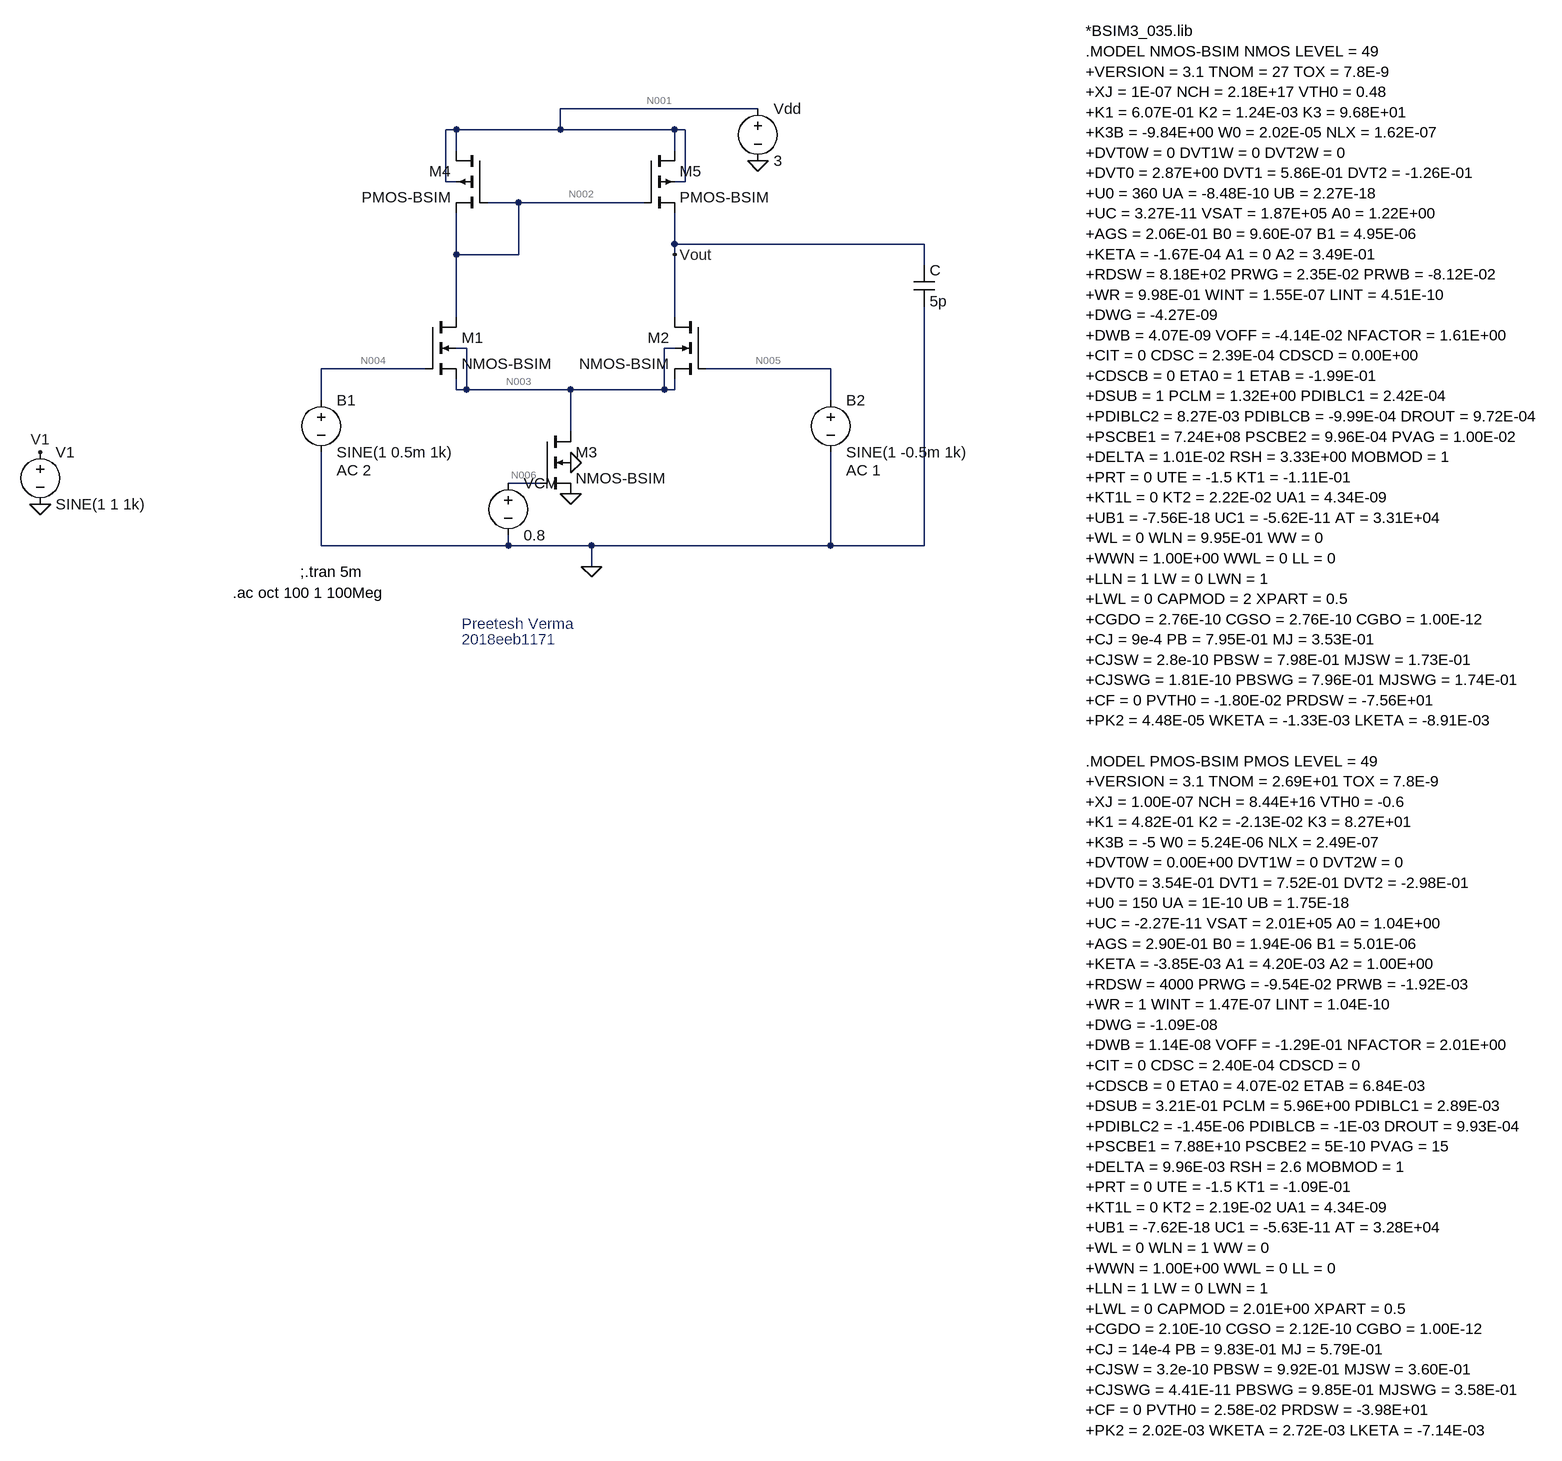
[diagram p0: schematic Question1.asc]
Question1.asc, the LTspice schematic file:
Version 4
SHEET 1 2096 1684
WIRE 528 -144 224 -144
WIRE 64 -112 48 -112
WIRE 224 -112 224 -144
WIRE 224 -112 64 -112
WIRE 400 -112 224 -112
WIRE 416 -112 400 -112
WIRE 64 -80 64 -112
WIRE 400 -80 400 -112
WIRE 48 -32 48 -112
WIRE 64 -32 48 -32
WIRE 416 -32 416 -112
WIRE 416 -32 400 -32
WIRE 160 0 112 0
WIRE 352 0 160 0
WIRE 400 64 400 16
WIRE 784 64 400 64
WIRE 64 80 64 16
WIRE 160 80 160 0
WIRE 160 80 64 80
WIRE 400 80 400 64
WIRE 784 96 784 64
WIRE 64 176 64 80
WIRE 400 176 400 80
WIRE 80 224 64 224
WIRE 400 224 384 224
WIRE 16 256 -144 256
WIRE 640 256 448 256
WIRE 64 288 64 272
WIRE 80 288 80 224
WIRE 80 288 64 288
WIRE 240 288 80 288
WIRE 384 288 384 224
WIRE 384 288 240 288
WIRE 400 288 400 272
WIRE 400 288 384 288
WIRE -144 304 -144 256
WIRE 640 304 640 256
WIRE 240 352 240 288
WIRE 192 432 144 432
WIRE -144 528 -144 384
WIRE 144 528 144 512
WIRE 144 528 -144 528
WIRE 272 528 144 528
WIRE 640 528 640 384
WIRE 640 528 272 528
WIRE 784 528 784 160
WIRE 784 528 640 528
WIRE 272 560 272 528
FLAG 528 -64 0
FLAG 400 80 Vout
FLAG 240 400 0
FLAG 240 448 0
FLAG -576 464 0
FLAG -576 384 V1
FLAG 272 560 0
SYMBOL nmos4 16 176 R0
SYMATTR InstName M1
SYMATTR Value NMOS-BSIM
SYMATTR Value2 l=27u w=160u
SYMBOL nmos4 448 176 M0
SYMATTR InstName M2
SYMATTR Value NMOS-BSIM
SYMATTR Value2 l=27u w=160u
SYMBOL pmos4 352 -80 R0
SYMATTR InstName M5
SYMATTR Value PMOS-BSIM
SYMATTR Value2 l=2.5u w=20u
SYMBOL pmos4 112 -80 M0
SYMATTR InstName M4
SYMATTR Value PMOS-BSIM
SYMATTR Value2 l=2.5u w=20u
SYMBOL voltage -144 288 R0
WINDOW 123 24 124 Left 2
WINDOW 39 0 0 Left 0
SYMATTR Value2 AC 2
SYMATTR InstName B1
SYMATTR Value SINE(1 0.5m 1k)
SYMBOL voltage 640 288 R0
WINDOW 123 24 124 Left 2
WINDOW 39 0 0 Left 0
SYMATTR Value2 AC 1
SYMATTR InstName B2
SYMATTR Value SINE(1 -0.5m 1k)
SYMBOL voltage 528 -160 R0
WINDOW 123 0 0 Left 0
WINDOW 39 0 0 Left 0
SYMATTR InstName Vdd
SYMATTR Value 3
SYMBOL cap 768 96 R0
SYMATTR InstName C
SYMATTR Value 5p
SYMBOL nmos4 192 352 R0
SYMATTR InstName M3
SYMATTR Value NMOS-BSIM
SYMATTR Value2 l=27u w=160u
SYMBOL voltage 144 416 R0
SYMATTR InstName VCM
SYMATTR Value 0.8
SYMBOL voltage -576 368 R0
WINDOW 123 0 0 Left 0
WINDOW 39 0 0 Left 0
SYMATTR InstName V1
SYMATTR Value SINE(1 1 1k)
TEXT -176 568 Left 2 !;.tran 5m
TEXT 1032 -264 Left 2 !*BSIM3_035.lib\n.MODEL NMOS-BSIM NMOS LEVEL = 49\n+VERSION = 3.1 TNOM = 27 TOX = 7.8E-9\n+XJ = 1E-07 NCH = 2.18E+17 VTH0 = 0.48\n+K1 = 6.07E-01 K2 = 1.24E-03 K3 = 9.68E+01\n+K3B = -9.84E+00 W0 = 2.02E-05 NLX = 1.62E-07\n+DVT0W = 0 DVT1W = 0 DVT2W = 0\n+DVT0 = 2.87E+00 DVT1 = 5.86E-01 DVT2 = -1.26E-01\n+U0 = 360 UA = -8.48E-10 UB = 2.27E-18\n+UC = 3.27E-11 VSAT = 1.87E+05 A0 = 1.22E+00\n+AGS = 2.06E-01 B0 = 9.60E-07 B1 = 4.95E-06\n+KETA = -1.67E-04 A1 = 0 A2 = 3.49E-01\n+RDSW = 8.18E+02 PRWG = 2.35E-02 PRWB = -8.12E-02\n+WR = 9.98E-01 WINT = 1.55E-07 LINT = 4.51E-10\n+DWG = -4.27E-09\n+DWB = 4.07E-09 VOFF = -4.14E-02 NFACTOR = 1.61E+00\n+CIT = 0 CDSC = 2.39E-04 CDSCD = 0.00E+00\n+CDSCB = 0 ETA0 = 1 ETAB = -1.99E-01\n+DSUB = 1 PCLM = 1.32E+00 PDIBLC1 = 2.42E-04\n+PDIBLC2 = 8.27E-03 PDIBLCB = -9.99E-04 DROUT = 9.72E-04\n+PSCBE1 = 7.24E+08 PSCBE2 = 9.96E-04 PVAG = 1.00E-02\n+DELTA = 1.01E-02 RSH = 3.33E+00 MOBMOD = 1\n+PRT = 0 UTE = -1.5 KT1 = -1.11E-01\n+KT1L = 0 KT2 = 2.22E-02 UA1 = 4.34E-09\n+UB1 = -7.56E-18 UC1 = -5.62E-11 AT = 3.31E+04\n+WL = 0 WLN = 9.95E-01 WW = 0\n+WWN = 1.00E+00 WWL = 0 LL = 0\n+LLN = 1 LW = 0 LWN = 1\n+LWL = 0 CAPMOD = 2 XPART = 0.5\n+CGDO = 2.76E-10 CGSO = 2.76E-10 CGBO = 1.00E-12\n+CJ = 9e-4 PB = 7.95E-01 MJ = 3.53E-01\n+CJSW = 2.8e-10 PBSW = 7.98E-01 MJSW = 1.73E-01\n+CJSWG = 1.81E-10 PBSWG = 7.96E-01 MJSWG = 1.74E-01\n+CF = 0 PVTH0 = -1.80E-02 PRDSW = -7.56E+01\n+PK2 = 4.48E-05 WKETA = -1.33E-03 LKETA = -8.91E-03\n \n.MODEL PMOS-BSIM PMOS LEVEL = 49\n+VERSION = 3.1 TNOM = 2.69E+01 TOX = 7.8E-9\n+XJ = 1.00E-07 NCH = 8.44E+16 VTH0 = -0.6\n+K1 = 4.82E-01 K2 = -2.13E-02 K3 = 8.27E+01\n+K3B = -5 W0 = 5.24E-06 NLX = 2.49E-07\n+DVT0W = 0.00E+00 DVT1W = 0 DVT2W = 0\n+DVT0 = 3.54E-01 DVT1 = 7.52E-01 DVT2 = -2.98E-01\n+U0 = 150 UA = 1E-10 UB = 1.75E-18\n+UC = -2.27E-11 VSAT = 2.01E+05 A0 = 1.04E+00\n+AGS = 2.90E-01 B0 = 1.94E-06 B1 = 5.01E-06\n+KETA = -3.85E-03 A1 = 4.20E-03 A2 = 1.00E+00\n+RDSW = 4000 PRWG = -9.54E-02 PRWB = -1.92E-03\n+WR = 1 WINT = 1.47E-07 LINT = 1.04E-10\n+DWG = -1.09E-08\n+DWB = 1.14E-08 VOFF = -1.29E-01 NFACTOR = 2.01E+00\n+CIT = 0 CDSC = 2.40E-04 CDSCD = 0\n+CDSCB = 0 ETA0 = 4.07E-02 ETAB = 6.84E-03\n+DSUB = 3.21E-01 PCLM = 5.96E+00 PDIBLC1 = 2.89E-03\n+PDIBLC2 = -1.45E-06 PDIBLCB = -1E-03 DROUT = 9.93E-04\n+PSCBE1 = 7.88E+10 PSCBE2 = 5E-10 PVAG = 15\n+DELTA = 9.96E-03 RSH = 2.6 MOBMOD = 1\n+PRT = 0 UTE = -1.5 KT1 = -1.09E-01\n+KT1L = 0 KT2 = 2.19E-02 UA1 = 4.34E-09\n+UB1 = -7.62E-18 UC1 = -5.63E-11 AT = 3.28E+04\n+WL = 0 WLN = 1 WW = 0\n+WWN = 1.00E+00 WWL = 0 LL = 0\n+LLN = 1 LW = 0 LWN = 1\n+LWL = 0 CAPMOD = 2.01E+00 XPART = 0.5\n+CGDO = 2.10E-10 CGSO = 2.12E-10 CGBO = 1.00E-12\n+CJ = 14e-4 PB = 9.83E-01 MJ = 5.79E-01\n+CJSW = 3.2e-10 PBSW = 9.92E-01 MJSW = 3.60E-01\n+CJSWG = 4.41E-11 PBSWG = 9.85E-01 MJSWG = 3.58E-01\n+CF = 0 PVTH0 = 2.58E-02 PRDSW = -3.98E+01\n+PK2 = 2.02E-03 WKETA = 2.72E-03 LKETA = -7.14E-03
TEXT -280 600 Left 2 !.ac oct 100 1 100Meg
TEXT 72 648 Left 2 ;Preetesh Verma
TEXT 72 672 Left 2 ;2018eeb1171

The netlist it stands for:
* Question1.asc
M1 N002 N004 N003 N003 NMOS-BSIM l=27u w=160u
M2 Vout N005 N003 N003 NMOS-BSIM l=27u w=160u
M5 N001 N002 Vout N001 PMOS-BSIM l=2.5u w=20u
M4 N001 N002 N002 N001 PMOS-BSIM l=2.5u w=20u
V§B1 N004 0 SINE(1 0.5m 1k) AC 2
V§B2 N005 0 SINE(1 -0.5m 1k) AC 1
Vdd N001 0 3
C Vout 0 5p
M3 N003 N006 0 0 NMOS-BSIM l=27u w=160u
VCM N006 0 0.8
V1 V1 0 SINE(1 1 1k)
.model NMOS NMOS
.model PMOS PMOS
.lib standard.mos
;.tran 5m
*BSIM3_035.lib
.MODEL NMOS-BSIM NMOS LEVEL = 49
+VERSION = 3.1 TNOM = 27 TOX = 7.8E-9
+XJ = 1E-07 NCH = 2.18E+17 VTH0 = 0.48
+K1 = 6.07E-01 K2 = 1.24E-03 K3 = 9.68E+01
+K3B = -9.84E+00 W0 = 2.02E-05 NLX = 1.62E-07
+DVT0W = 0 DVT1W = 0 DVT2W = 0
+DVT0 = 2.87E+00 DVT1 = 5.86E-01 DVT2 = -1.26E-01
+U0 = 360 UA = -8.48E-10 UB = 2.27E-18
+UC = 3.27E-11 VSAT = 1.87E+05 A0 = 1.22E+00
+AGS = 2.06E-01 B0 = 9.60E-07 B1 = 4.95E-06
+KETA = -1.67E-04 A1 = 0 A2 = 3.49E-01
+RDSW = 8.18E+02 PRWG = 2.35E-02 PRWB = -8.12E-02
+WR = 9.98E-01 WINT = 1.55E-07 LINT = 4.51E-10
+DWG = -4.27E-09
+DWB = 4.07E-09 VOFF = -4.14E-02 NFACTOR = 1.61E+00
+CIT = 0 CDSC = 2.39E-04 CDSCD = 0.00E+00
+CDSCB = 0 ETA0 = 1 ETAB = -1.99E-01
+DSUB = 1 PCLM = 1.32E+00 PDIBLC1 = 2.42E-04
+PDIBLC2 = 8.27E-03 PDIBLCB = -9.99E-04 DROUT = 9.72E-04
+PSCBE1 = 7.24E+08 PSCBE2 = 9.96E-04 PVAG = 1.00E-02
+DELTA = 1.01E-02 RSH = 3.33E+00 MOBMOD = 1
+PRT = 0 UTE = -1.5 KT1 = -1.11E-01
+KT1L = 0 KT2 = 2.22E-02 UA1 = 4.34E-09
+UB1 = -7.56E-18 UC1 = -5.62E-11 AT = 3.31E+04
+WL = 0 WLN = 9.95E-01 WW = 0
+WWN = 1.00E+00 WWL = 0 LL = 0
+LLN = 1 LW = 0 LWN = 1
+LWL = 0 CAPMOD = 2 XPART = 0.5
+CGDO = 2.76E-10 CGSO = 2.76E-10 CGBO = 1.00E-12
+CJ = 9e-4 PB = 7.95E-01 MJ = 3.53E-01
+CJSW = 2.8e-10 PBSW = 7.98E-01 MJSW = 1.73E-01
+CJSWG = 1.81E-10 PBSWG = 7.96E-01 MJSWG = 1.74E-01
+CF = 0 PVTH0 = -1.80E-02 PRDSW = -7.56E+01
+PK2 = 4.48E-05 WKETA = -1.33E-03 LKETA = -8.91E-03
.MODEL PMOS-BSIM PMOS LEVEL = 49
+VERSION = 3.1 TNOM = 2.69E+01 TOX = 7.8E-9
+XJ = 1.00E-07 NCH = 8.44E+16 VTH0 = -0.6
+K1 = 4.82E-01 K2 = -2.13E-02 K3 = 8.27E+01
+K3B = -5 W0 = 5.24E-06 NLX = 2.49E-07
+DVT0W = 0.00E+00 DVT1W = 0 DVT2W = 0
+DVT0 = 3.54E-01 DVT1 = 7.52E-01 DVT2 = -2.98E-01
+U0 = 150 UA = 1E-10 UB = 1.75E-18
+UC = -2.27E-11 VSAT = 2.01E+05 A0 = 1.04E+00
+AGS = 2.90E-01 B0 = 1.94E-06 B1 = 5.01E-06
+KETA = -3.85E-03 A1 = 4.20E-03 A2 = 1.00E+00
+RDSW = 4000 PRWG = -9.54E-02 PRWB = -1.92E-03
+WR = 1 WINT = 1.47E-07 LINT = 1.04E-10
+DWG = -1.09E-08
+DWB = 1.14E-08 VOFF = -1.29E-01 NFACTOR = 2.01E+00
+CIT = 0 CDSC = 2.40E-04 CDSCD = 0
+CDSCB = 0 ETA0 = 4.07E-02 ETAB = 6.84E-03
+DSUB = 3.21E-01 PCLM = 5.96E+00 PDIBLC1 = 2.89E-03
+PDIBLC2 = -1.45E-06 PDIBLCB = -1E-03 DROUT = 9.93E-04
+PSCBE1 = 7.88E+10 PSCBE2 = 5E-10 PVAG = 15
+DELTA = 9.96E-03 RSH = 2.6 MOBMOD = 1
+PRT = 0 UTE = -1.5 KT1 = -1.09E-01
+KT1L = 0 KT2 = 2.19E-02 UA1 = 4.34E-09
+UB1 = -7.62E-18 UC1 = -5.63E-11 AT = 3.28E+04
+WL = 0 WLN = 1 WW = 0
+WWN = 1.00E+00 WWL = 0 LL = 0
+LLN = 1 LW = 0 LWN = 1
+LWL = 0 CAPMOD = 2.01E+00 XPART = 0.5
+CGDO = 2.10E-10 CGSO = 2.12E-10 CGBO = 1.00E-12
+CJ = 14e-4 PB = 9.83E-01 MJ = 5.79E-01
+CJSW = 3.2e-10 PBSW = 9.92E-01 MJSW = 3.60E-01
+CJSWG = 4.41E-11 PBSWG = 9.85E-01 MJSWG = 3.58E-01
+CF = 0 PVTH0 = 2.58E-02 PRDSW = -3.98E+01
+PK2 = 2.02E-03 WKETA = 2.72E-03 LKETA = -7.14E-03
.ac oct 100 1 100Meg
* Preetesh Verma
* 2018eeb1171
.backanno
.end

* Results of the author's LTspice run, read from the files saved beside the schematic
* Operating Point, zero values left out:
*   V(n002) = 2.07 V
*   V(n004) = 1 V
*   V(n003) = 284 mV
*   V(vout) = 2.07 V
*   V(n005) = 1 V
*   V(n001) = 3 V
*   V(n006) = 800 mV
*   V(v1) = 1 V
*   Id(M4) = 18.98 µA
*   Is(M4) = -18.98 µA
*   Id(M5) = 18.98 µA
*   Is(M5) = -18.98 µA
*   Id(M3) = 37.96 µA
*   Is(M3) = -37.96 µA
*   Id(M2) = 18.98 µA
*   Ib(M2) = -1.796 pA
*   Is(M2) = -18.98 µA
*   Id(M1) = 18.98 µA
*   Ib(M1) = -1.796 pA
*   Is(M1) = -18.98 µA
*   I(Vdd) = -37.96 µA
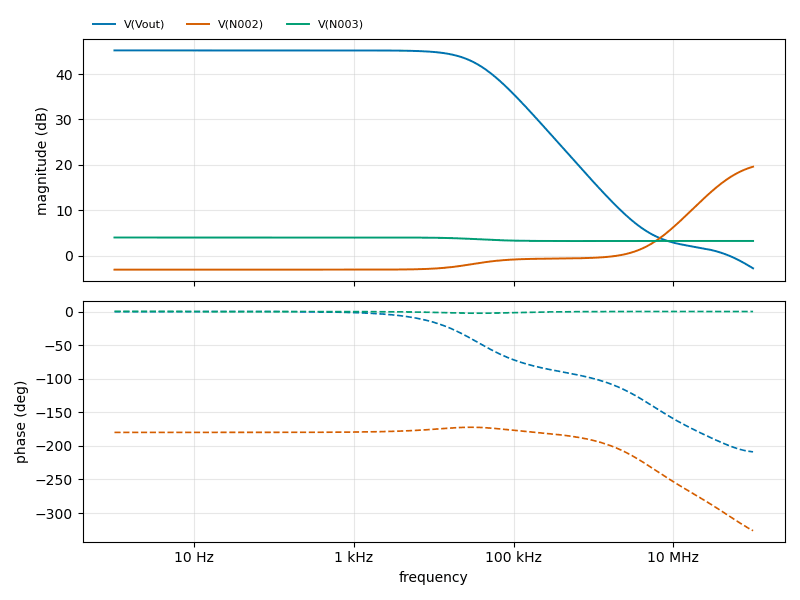
[diagram p1: AC Analysis of Question1.asc, plotted from the saved traces]
* AC Analysis, 1 run:
*   V(Vout): 45.20 dB at 1 Hz, -2.80 dB at 100 MHz, peak 45.20 dB at 1 Hz, 3 dB below the peak at 34.96 kHz
*   V(N002): -3.10 dB at 1 Hz, 19.59 dB at 100 MHz, peak 19.59 dB at 100 MHz, 3 dB below the peak at 45.21 MHz
*   V(N003): 3.99 dB at 1 Hz, 3.23 dB at 100 MHz, peak 3.99 dB at 1 Hz